# EasyEDA schematic LDR_Circuit.json
TITLE: Sheet_1; Date: 2019-10-02; Sheet: 1/1; Drawn By: dipb653; Company: Your Company
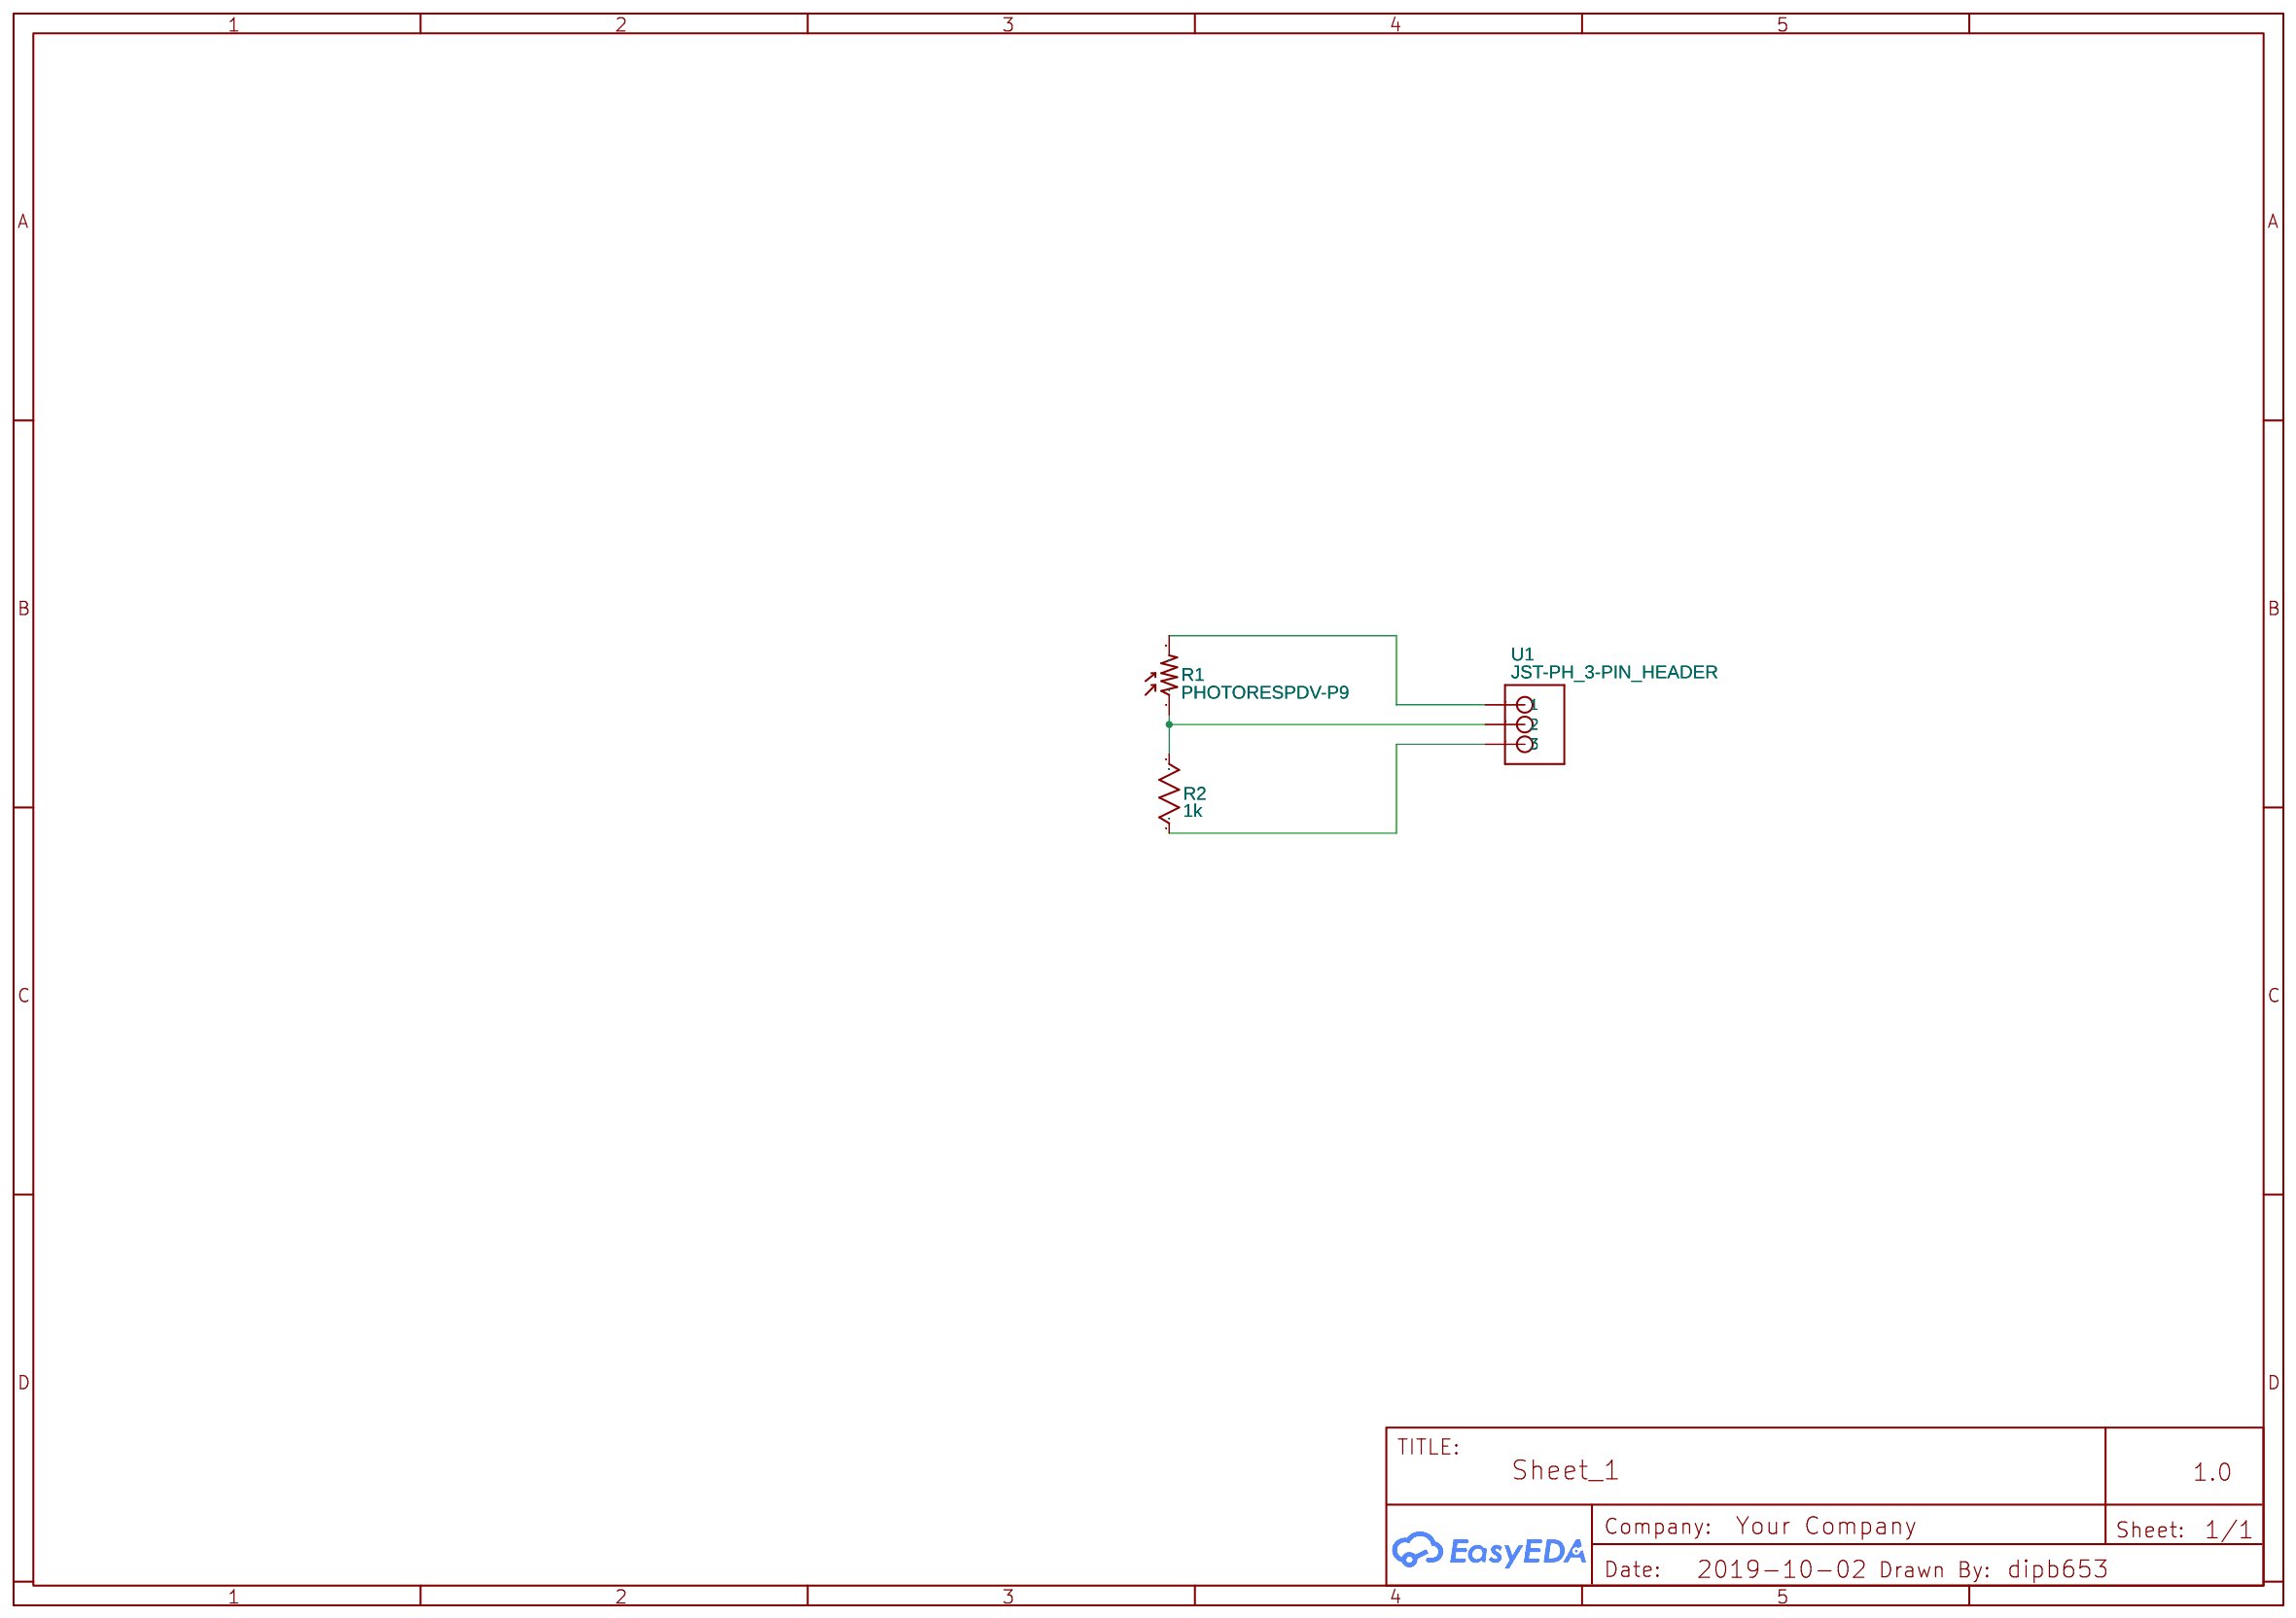
[diagram p0: schematic sheet]

## Parts
R1  PHOTORESPDV-P9  [PDV-P9XXX]
R2  1k  [AXIAL-0.3]
U1  JST-PH_3-PIN_HEADER  [JST_B3B-PH_HEADER]

## Library data of the parts
R2 = Res_AXIAL-0.3(1/8W)_US

## Nets
Net-(R1-1): R1.1 R2.2 U1.P2(2)
Net-(R1-2): R1.2 U1.P1(1)
Net-(R2-1): R2.1 U1.P3(3)
